# Altium schematic sheet MCU_Main.SchDoc
size A4; SheetNumber: 1; SheetTotal: 4
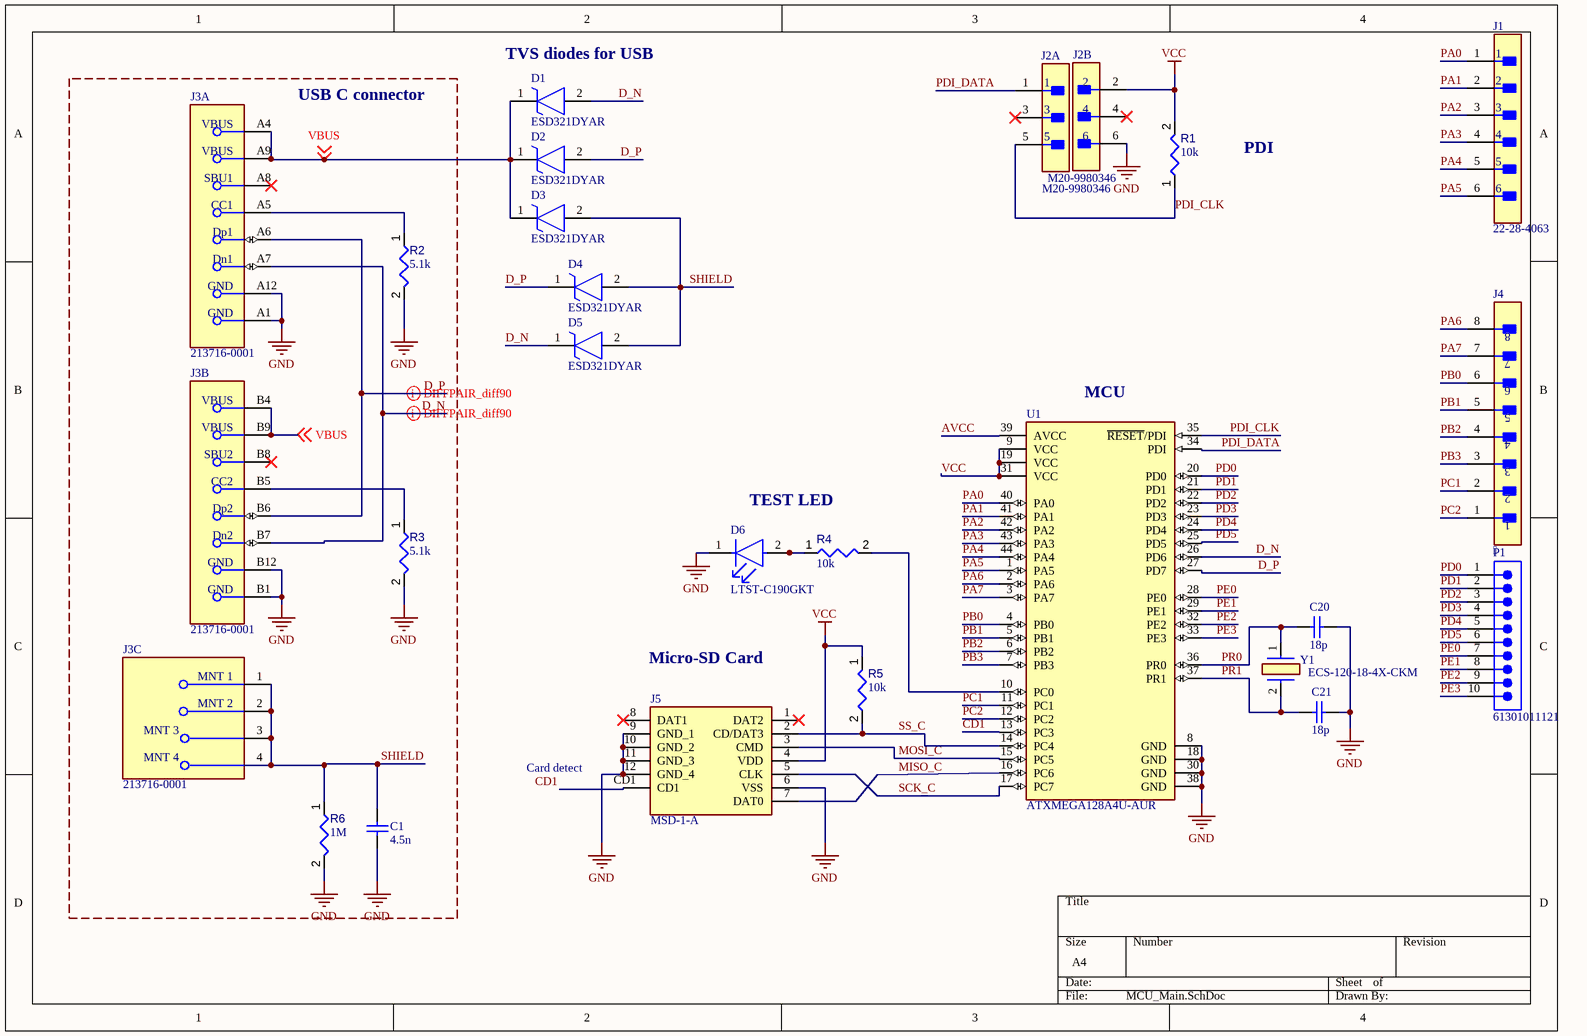
[diagram p0: MCU_Main.SchDoc]

## Parts
C1  4.5n  [WCAP-CSGP_0402_L1W0.5H0.5]
C20  18p  [WCAP-CSGP_0402_L1W0.5H0.5]
C21  18p  [WCAP-CSGP_0402_L1W0.5H0.5]
D1  ESD321DYAR  [SODFL1608X77N]
D2  ESD321DYAR  [SODFL1608X77N]
D3  ESD321DYAR  [SODFL1608X77N]
D4  ESD321DYAR  [SODFL1608X77N]
D5  ESD321DYAR  [SODFL1608X77N]
D6  LTST-C190GKT  [FP-LTST-C190GKT-MFG]
J1  22-28-4063  [FP-22-28-4063-MFG]
J2  M20-9980346  [FP-M20-9980346-MFG]  (parts A,B of 2)
J3  213716-0001  [FP-213716-0001-MFG]  (parts A,B,C of 3)
J4    [FP-M20-9990846-MFG]
J5  MSD-1-A  [MSD1A]
P1  61301011121  [61301011121]
R1  value 10k  [RESC1005X40X25ML05T05]  (hidden comment: Resistor 4k7 +/-1% 0402 63 mW)
R2  value 5.1k  [RESC1005X40X25ML05T05]  (hidden comment: Resistor 4k7 +/-1% 0402 63 mW)
R3  value 5.1k  [RESC1005X40X25ML05T05]  (hidden comment: Resistor 4k7 +/-1% 0402 63 mW)
R4  value 10k  [RESC1005X40X25ML05T05]  (hidden comment: Resistor 4k7 +/-1% 0402 63 mW)
R5  value 10k  [RESC1005X40X25ML05T05]  (hidden comment: Resistor 4k7 +/-1% 0402 63 mW)
R6  value 1M  [RESC1005X40X25ML05T05]  (hidden comment: Resistor 4k7 +/-1% 0402 63 mW)
U1  ATXMEGA128A4U-AUR  [FP-C04-076-IPC_A]
Y1  ECS-120-18-4X-CKM  [ECS120184XCKM]

## Blocks framed on the sheet
USB C connector: C1 J3 R2 R3 R6

## Nets
GND: C1.1 C20.1 C21.1 D6.1(C) J2.6 J3.A1(GND) J3.A12(GND) J3.B1(GND) J3.B12(GND) J5.6(VSS) J5.9(GND_1) J5.10(GND_2) J5.11(GND_3) J5.12(GND_4) R2.2 R3.2 R6.2 U1.8(GND) U1.18(GND) U1.30(GND) U1.38(GND)
VCC: J2.2 J5.4(VDD) R1.2 R5.1 U1.9(VCC) U1.19(VCC) U1.31(VCC)
AVCC: U1.39(AVCC)
CD1: J5.CD1 U1.13(PC3)
D_N: D1.2(A) D5.1(K) J3.A7(Dn1) J3.B7(Dn2) U1.26(PD6)
D_P: D2.2(A) D4.1(K) J3.A6(Dp1) J3.B6(Dp2) U1.27(PD7)
MISO_C: J5.7(DAT0) U1.16(PC6)
MOSI_C: J5.3(CMD) U1.15(PC5)
PA0: J1.1 U1.40(PA0)
PA1: J1.2 U1.41(PA1)
PA2: J1.3 U1.42(PA2)
PA3: J1.4 U1.43(PA3)
PA4: J1.5 U1.44(PA4)
PA5: J1.6 U1.1(PA5)
PA6: J4.8 U1.2(PA6)
PA7: J4.7 U1.3(PA7)
PB0: J4.6 U1.4(PB0)
PB1: J4.5 U1.5(PB1)
PB2: J4.4 U1.6(PB2)
PB3: J4.3 U1.7(PB3)
PC1: J4.2 U1.11(PC1)
PC2: J4.1 U1.12(PC2)
PD0: P1.1 U1.20(PD0)
PD1: P1.2 U1.21(PD1)
PD2: P1.3 U1.22(PD2)
PD3: P1.4 U1.23(PD3)
PD4: P1.5 U1.24(PD4)
PD5: P1.6 U1.25(PD5)
PDI_CLK: J2.5 R1.1 U1.35(~{RESET}/PDI)
PDI_DATA: J2.1 U1.34(PDI)
PE0: P1.7 U1.28(PE0)
PE1: P1.8 U1.29(PE1)
PE2: P1.9 U1.32(PE2)
PE3: P1.10 U1.33(PE3)
PR0: C20.2 U1.36(PR0) Y1.1(CRYSTAL_1)
PR1: C21.2 U1.37(PR1) Y1.2(CRYSTAL_2)
SCK_C: J5.5(CLK) U1.17(PC7)
SHIELD: C1.2 D3.2(A) D4.2(A) D5.2(A) J3.1(MNT_1) J3.2(MNT_2) J3.3(MNT_3) J3.4(MNT_4) R6.1
SS_C: J5.2(CD/DAT3) R5.2 U1.14(PC4)
VBUS: D1.1(K) D2.1(K) D3.1(K) J3.A4(VBUS) J3.A9(VBUS) J3.B4(VBUS) J3.B9(VBUS) ; off-sheet VBUS
NetD6_2: D6.2(A) R4.1
NetJ3_A5: J3.A5(CC1) R2.1
NetJ3_B5: J3.B5(CC2) R3.1
NetR4_2: R4.2 U1.10(PC0)

Not connected (* = marked no-connect by the designer): J2 3* 4*; J3 A8(SBU1)* B8(SBU2)*; J5 1(DAT2)* 8(DAT1)*

## Layout directives
differential pair; differential pair class diff90: D_N, D_P

## Notes on the sheet
- (near D1) TVS diodes for USB
- PDI
- (near U1) MCU
- TEST LED
- (near J5) Micro-SD Card
- Card detect

## Library data of the parts
C1 C20 C21 = CMP-207839-000017-2: CAP CER 10000PF 50V X7R 0402; NexarPartId: 53703204; Insulation Resistance: 10GΩ; Material: Ceramic; Tolerance: 10%; Capacitance: 10nF; Packaging: Tape & Reel (TR); Voltage Rating: 50V; Thickness: 558.8µm; Case Code (Imperial): 0402; Dielectric: X7R; Mount: Surface Mount; Width: 500µm; Height: 500µm; Min Operating Temperature: -55°C; Case/Package: 0402; RoHS: Compliant; Case Code (Metric): 1005; REACH SVHC: Unknown; Max Operating Temperature: 125°C; Voltage Rating (DC): 50V; Length: 1mm
D1-D5 = ESD321DYAR: TVS Diode (Uni-directional); Manufacturer_Name: Texas Instruments; Datasheet Link: https://www.ti.com/lit/ds/symlink/esd321.pdf?HQS=dis-mous-null-mousermode-dsf-pf-null-wwe&ts=1699925294630&ref_url=https%253A%252F%252Fwww.mouser.com%252F; Height: 0.77mm; Manufacturer_Part_Number: ESD321DYAR; Mouser Part Number: 595-ESD321DYAR; Mouser Price/Stock: https://www.mouser.co.uk/ProductDetail/Texas-Instruments/ESD321DYAR?qs=rQFj71Wb1eXoYwRMra0IYA%3D%3D; Arrow Part Number: ESD321DYAR; Arrow Price/Stock: https://www.arrow.com/en/products/esd321dyar/texas-instruments?utm_currency=USD&region=nac
D6 = CMP-22017-000005-2: LED GREEN CLEAR CHIP SMD; Dominant Wavelength: 569nm; Reverse Voltage: 5V; Lens Color: Colorless; Viewing Angle: 130°; Voltage: 2V; Forward Current: 30mA; Power Dissipation: 100mW; Luminous Intensity: 6mcd; Number of LEDs: 1; Forward Voltage: 2.1V; Wavelength: 565nm; Test Current: 10mA; Min Operating Temperature: -55°C; Lens Style: Clear; Mount: Surface Mount; Width: 0.8mm; Packaging: Tape and Reel; Lens Transparency: Clear; Case Code (Metric): 1608; Depth: 0.8mm; Case Code (Imperial): 0603; Case/Package: 0603; Number of Pins: 2; Max Operating Temperature: 85°C; Lead Free: Lead Free; Number of Elements: 1; Length: 1.6mm; Height: 0.8mm; Package Quantity: 1; Power Rating: 100mW; Radiation Hardening: No; Illumination Color: Green; Color: Green
J1 = CMP-04776-000885-1: CONN HEADER VERT 6POS 2.54MM; Number of Circuits: 6; Voltage Rating (DC): 250V; Connector Type: Male Pin; Contact Resistance: 20mR; Glow Wire Compliant: Non-compliant; Gender: Male; Current Rating: 4A; Max Voltage Rating (DC): 250.25kV; Series: KK® 42375; Termination: Solder; Orientation: Straight; Max Operating Temperature: 75°C; Min Operating Temperature: 0°C; Mount: Through Hole; Depth: 2.49mm; Contact Material: Brass; Number of Positions: 6; Contact Mating Length: 0.24inch; Number of Rows: 1; Housing Color: Black; Max Voltage Rating (AC): 250V; Housing Material: Thermoplastic; Packaging: Bulk; Contact Plating: Gold; Contact Type: Male Pin; Package Quantity: 1; Number of Contacts: 6; Voltage Rating: 250V; Lead Free: Lead Free; RoHS Compliant: Yes; Pitch: 2.54mm; Color: Black; Flammability Rating: UL94 V-0; Radiation Hardening: No
J2 = CMP-2000-06636-2: CONN HEADER VERT 6POS 2.54MM; Manufacturer: Harwin; Current Rating: 3A; Number Of Contacts: 6; Conn Gender: Male; Conn Orientation: Vertical; Device Class L1: Connectors; ComponentLink2Description: Datasheet; Height: 8.99mm; Temperature Range High: +105°C; Contact Material: Tin,Nickel; RoHS: TRUE; Temperature Range Low: -40°C; ComponentLink2URL: https://cdn.harwin.com/pdfs/M20-998.pdf; Digikey Description: CONN HEADER VERT 6POS 2.54MM; Pitch: 2.54mm; Package: M20-9980346; Device Class L2: Headers and Wire Housings; Manufacturer Part Number: M20-9980346; Number Of Rows: 2; Category: Conn; Lead Free: Yes; Mouser Description: 2.54mm (0.1") Pitch DIL Vertical PC Tail Pin Header, 6.1mm mating pin height, tin, 3+3 contacts; Temperature: -40°C to +105°C; Device Class L3: unset; Octopart: https://octopart.com/m20-9980346-harwin-5436545; Automotive: No
J3 = CMP-04767-000029-1: CONN RCPT USB2.0 TYPE C 24POS RA
J4 = CMP-15831-000033-1: CONN HEADER VERT 8POS 2.54MM; Connector Type: Male Pin; Gender: Male; Insulation Resistance: 1GR; Number of Positions: 8; Contact Resistance: 30mR; Current Rating: 3A; Termination: Solder; Case/Package: SIL; RoHS Compliant: Yes; Series: M20; Housing Material: Nylon; Radiation Hardening: No; Package Quantity: 1000; Contact Material: Brass; Contact Plating: Tin; Max Operating Temperature: 105°C; Contact Mating Length: 0.24inch; Depth: 2.54mm; Color: Black; Number of Contacts: 8; Mount: Through Hole; Number of Rows: 1; Packaging: Bulk; Min Operating Temperature: -40°C; Max Current Rating: 3A; REACH SVHC: No SVHC; Pitch: 2.54mm; Housing Color: Black; Orientation: Straight; Length: 20.32mm; Contact Type: Male Pin
J5 = MSD-1-A: Connector; Manufacturer_Name: Same Sky; Datasheet Link: https://www.sameskydevices.com/product/resource/supplyframepdf/msd-1-a.pdf; Height: 2mm; Manufacturer_Part_Number: MSD-1-A; Mouser Part Number: 179-MSD-1-A; Mouser Price/Stock: https://www.mouser.co.uk/ProductDetail/Same-Sky/MSD-1-A?qs=Z%252BL2brAPG1Ip18XLC4tUPQ%3D%3D; Arrow Part Number: MSD-1-A; Arrow Price/Stock: https://www.arrow.com/en/products/msd-1-a/cui-devices?utm_currency=USD&region=nac
P1 = CMP-1502-01082-5: NexarPartId: 18818159; Gender: Male; Number of Positions: 10; Operating Supply Voltage: 250V; Current Rating: 3A; Contact Resistance: 20mΩ; Connector Type: Male Pin; Insulation Resistance: 1GΩ; Pitch: 2.54mm; Color: Black; Contact Gender: Male; Height: 8.74mm; Orientation: Vertical; RoHS: Compliant; Packaging: Bulk; Min Operating Temperature: -40°C; Number of Pins: 10; Max Operating Temperature: 105°C; REACH SVHC: Unknown; Voltage Rating: 250V; Number of Rows: 1; Housing Material: PBT; Number of Contacts: 10; Mount: Through Hole; Contact Mating Length: 5.9944mm; Length: 2.54mm; Lead Pitch: 2.54mm; Flammability Rating: UL94 V-0; Termination: Solder; Contact Material: Copper; Width: 25.4mm; Contact Plating: Gold
R1-R6 = CMP-009-00034-5: Chip Resistor, 4.7 KOhm, +/- 1%, 63 mW, -55 to 155 degC, 0402 (1005 Metric); Power: 63mW; Voltage Rating: 50V; Case/Package: 0402; Tolerance: 1%; Max Operating Temperature: 155°C; Pins: 2; RoHS Compliant: True; Min Operating Temperature: -55°C; Mounting Technology: SM
U1 = CMP-06276-000232-1: IC MCU 8/16BIT 128KB FLSH 44TQFP; Oscillator Type: Internal; Core Architecture: AVR; Frequency: 32MHz; Memory Type: FLASH; Interface: I2C; Peripherals: Brown-out Detect/Reset; Number of I/Os: 34; Memory Size: 128KB; Series: AVR® XMEGA® A4U; Number of Pins: 44; Max Operating Temperature: 85°C; Min Operating Temperature: -40°C; Packaging: Tape and Reel; RoHS Compliant: Yes; Case/Package: TQFP
Y1 = ECS-120-18-4X-CKM: Crystal or Oscillator; Manufacturer_Name: ECS; Datasheet Link: https://datasheet.datasheetarchive.com/originals/distributors/Datasheets_SAMA/01ba4890a7eb6724763e09cbcd53f1e6.pdf; Height: 3.5mm; Manufacturer_Part_Number: ECS-120-18-4X-CKM; Mouser Part Number: 520-ECS120-18-4X-CKM; Mouser Price/Stock: https://www.mouser.co.uk/ProductDetail/ECS/ECS-120-18-4X-CKM?qs=7MVldsJ5Uayqj3jfg9wxgA%3D%3D; Arrow Part Number: ECS-120-18-4X-CKM; Arrow Price/Stock: https://www.arrow.com/en/products/ecs-120-18-4x-ckm/ecs-international?utm_currency=USD&region=nac